# Altium schematic sheet HighCurrentLED.SchDoc
size A
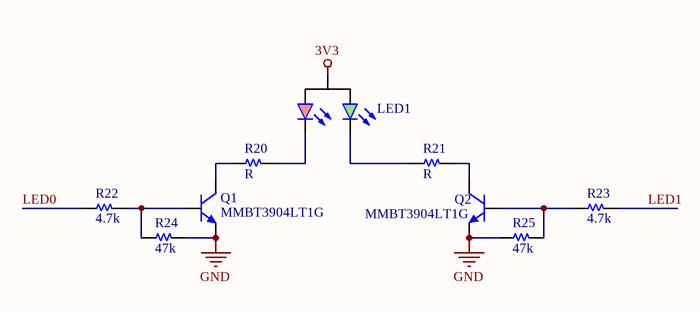
[diagram p0: HighCurrentLED.SchDoc]

## Parts
LED1  Led 3pin 2color  [LED 3PIN 2COLOR 5MM]  (value not drawn)
Q1  MMBT3904LT1G  [SOT-23]
Q2  MMBT3904LT1G  [SOT-23]
R20  R  [R 0805]
R21  R  [R 0805]
R22  4.7k  [R 0805]
R23  4.7k  [R 0805]
R24  47k  [R 0805]
R25  47k  [R 0805]

## Nets
3V3: LED1.2(A)
GND: Q1.2(E) Q2.2(E) R24.2 R25.1
LED0: R22.1
LED1: R23.2
NetLED1_1: LED1.1(RK) R20.2
NetLED1_3: LED1.3(YK) R21.1
NetQ1_1: Q1.1(B) R22.2 R24.1
NetQ1_3: Q1.3(C) R20.1
NetQ2_1: Q2.1(B) R23.1 R25.2
NetQ2_3: Q2.3(C) R21.2

## Library data of the parts
LED1 = Led 3pin 2color: Typical LED 3-pin 2-color
Q1 Q2 = Transistor NPN: NPN Bipolar Transistor
R20-R25 = Resistor